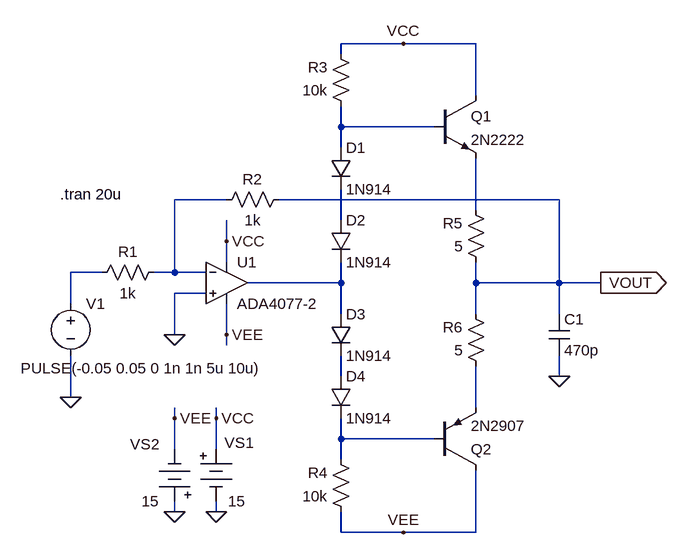
[diagram p0: schematic fig-03-01-45.asc]
fig-03-01-45.asc, the LTspice schematic file:
Version 4
SHEET 1 1420 836
WIRE 480 -192 384 -192
WIRE 592 -192 480 -192
WIRE 384 -176 384 -192
WIRE 592 -112 592 -192
WIRE 384 -64 384 -96
WIRE 528 -64 384 -64
WIRE 384 -32 384 -64
WIRE 208 48 128 48
WIRE 720 48 288 48
WIRE 592 64 592 -16
WIRE 384 80 384 32
WIRE 208 112 208 80
WIRE 208 144 208 112
WIRE 16 160 -32 160
WIRE 128 160 128 48
WIRE 128 160 96 160
WIRE 176 160 128 160
WIRE 384 176 384 144
WIRE 384 176 240 176
WIRE 592 176 592 144
WIRE 720 176 720 48
WIRE 720 176 592 176
WIRE 784 176 720 176
WIRE 176 192 128 192
WIRE -32 208 -32 160
WIRE 384 224 384 176
WIRE 592 224 592 176
WIRE 720 224 720 176
WIRE 128 256 128 192
WIRE 208 256 208 208
WIRE 208 272 208 256
WIRE 384 320 384 288
WIRE 720 320 720 288
WIRE -32 352 -32 288
WIRE 592 368 592 304
WIRE 128 384 128 368
WIRE 192 384 192 368
WIRE 384 416 384 384
WIRE 528 416 384 416
WIRE 128 432 128 384
WIRE 192 432 192 384
WIRE 384 448 384 416
WIRE 128 528 128 512
WIRE 192 528 192 512
WIRE 384 560 384 528
WIRE 480 560 384 560
WIRE 592 560 592 464
WIRE 592 560 480 560
FLAG 128 256 0
FLAG -32 352 0
FLAG 128 528 0
FLAG 192 528 0
FLAG 128 384 VEE
FLAG 192 384 VCC
FLAG 208 112 VCC
FLAG 208 256 VEE
FLAG 720 320 0
FLAG 480 560 VEE
FLAG 480 -192 VCC
FLAG 784 176 VOUT
IOPIN 784 176 Out
SYMBOL res 304 32 R90
WINDOW 0 0 56 VBottom 2
WINDOW 3 32 56 VTop 2
SYMATTR InstName R2
SYMATTR Value 1k
SYMBOL Misc\\battery 192 416 R0
WINDOW 0 13 6 Left 2
WINDOW 3 18 96 Left 2
SYMATTR InstName VS1
SYMATTR Value 15
SYMBOL Misc\\battery 128 528 R180
WINDOW 0 24 104 Left 2
WINDOW 3 24 16 Left 2
SYMATTR InstName VS2
SYMATTR Value 15
SYMBOL Opamps\\ADA4077-2 208 112 R0
SYMATTR InstName U1
SYMBOL res 112 144 R90
WINDOW 0 0 56 VBottom 2
WINDOW 3 32 56 VTop 2
SYMATTR InstName R1
SYMATTR Value 1k
SYMBOL voltage -32 192 R0
WINDOW 3 -77 115 Left 2
WINDOW 123 0 0 Left 0
WINDOW 39 0 0 Left 0
SYMATTR Value PULSE(-0.05 0.05 0 1n 1n 5u 10u)
SYMATTR InstName V1
SYMBOL cap 704 224 R0
SYMATTR InstName C1
SYMATTR Value 470p
SYMBOL res 400 -80 R180
WINDOW 0 36 76 Left 2
WINDOW 3 36 40 Left 2
SYMATTR InstName R3
SYMATTR Value 10k
SYMBOL npn 528 -112 R0
SYMATTR InstName Q1
SYMATTR Value 2N2222
SYMBOL res 400 544 R180
WINDOW 0 36 76 Left 2
WINDOW 3 36 40 Left 2
SYMATTR InstName R4
SYMATTR Value 10k
SYMBOL pnp 528 464 M180
SYMATTR InstName Q2
SYMATTR Value 2N2907
SYMBOL diode 368 -32 R0
SYMATTR InstName D1
SYMATTR Value 1N914
SYMBOL diode 368 80 R0
SYMATTR InstName D2
SYMATTR Value 1N914
SYMBOL res 608 160 R180
WINDOW 0 36 76 Left 2
WINDOW 3 36 40 Left 2
SYMATTR InstName R5
SYMATTR Value 5
SYMBOL res 608 320 R180
WINDOW 0 36 76 Left 2
WINDOW 3 36 40 Left 2
SYMATTR InstName R6
SYMATTR Value 5
SYMBOL diode 368 224 R0
SYMATTR InstName D3
SYMATTR Value 1N914
SYMBOL diode 368 320 R0
SYMATTR InstName D4
SYMATTR Value 1N914
TEXT -48 40 Left 2 !.tran 20u

The netlist it stands for:
* fig-03-01-45.asc
R2 VOUT N002 1k
VS1 VCC 0 15
VS2 0 VEE 15
XU1 0 N002 VCC VEE N006 ADA4077-2  ; pins In+ In- V+ V- OUT
R1 N002 N005 1k
V1 N005 0 PULSE(-0.05 0.05 0 1n 1n 5u 10u)
C1 VOUT 0 470p
R3 N001 VCC 10k
Q1 VCC N001 N003 0 2N2222
R4 VEE N009 10k
Q2 VEE N009 N008 0 2N2907
D1 N001 N004 1N914
D2 N004 N006 1N914
R5 VOUT N003 5
R6 N008 VOUT 5
D3 N006 N007 1N914
D4 N007 N009 1N914
.model D D
.lib standard.dio
.model NPN NPN
.model PNP PNP
.lib standard.bjt
.tran 20u
.backanno
.end